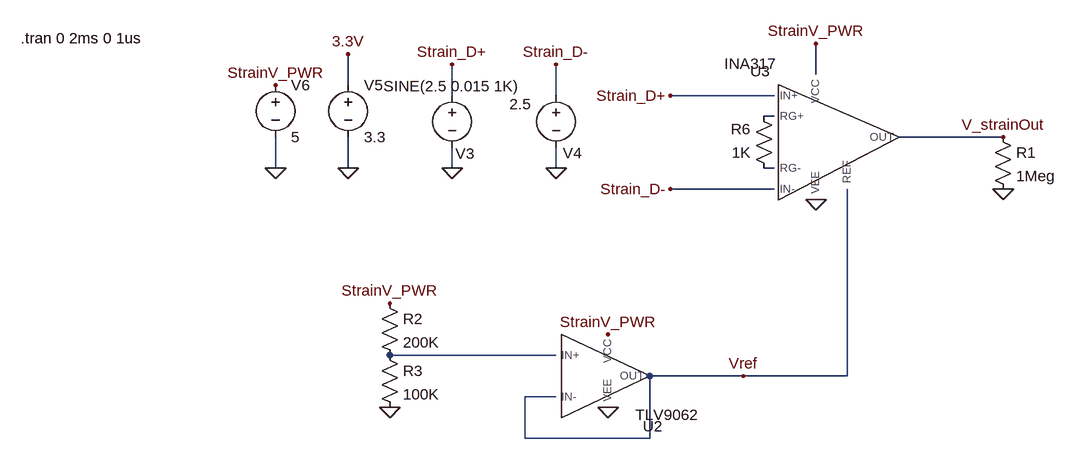
[diagram p0: schematic strainAmplifier.asc]
strainAmplifier.asc, the LTspice schematic file:
Version 4.1
SHEET 1 2284 1760
WIRE 1840 -320 1840 -368
WIRE 1120 -304 1120 -352
WIRE 1280 -288 1280 -336
WIRE 1440 -288 1440 -336
WIRE 1776 -288 1616 -288
WIRE 1776 -256 1760 -256
WIRE 2128 -224 1968 -224
WIRE 1008 -176 1008 -224
WIRE 1120 -176 1120 -224
WIRE 1280 -176 1280 -208
WIRE 1440 -176 1440 -208
WIRE 1776 -176 1760 -176
WIRE 1776 -144 1616 -144
WIRE 1440 112 1184 112
WIRE 1728 144 1584 144
WIRE 1888 144 1888 -144
WIRE 1888 144 1728 144
WIRE 1440 176 1392 176
WIRE 1392 240 1392 176
WIRE 1584 240 1584 144
WIRE 1584 240 1392 240
FLAG 1280 -336 Strain_D+
FLAG 1440 -336 Strain_D-
FLAG 1616 -288 Strain_D+
FLAG 1616 -144 Strain_D-
FLAG 1840 -368 StrainV_PWR
FLAG 1840 -128 0
FLAG 1280 -176 0
FLAG 1440 -176 0
FLAG 1120 -176 0
FLAG 1120 -352 3.3V
FLAG 1008 -176 0
FLAG 1008 -304 StrainV_PWR
FLAG 1728 144 Vref
FLAG 1184 32 StrainV_PWR
FLAG 1184 192 0
FLAG 1520 80 StrainV_PWR
FLAG 1520 192 0
FLAG 2128 -144 0
FLAG 2128 -224 V_strainOut
SYMBOL voltage 1280 -304 R0
WINDOW 0 20 90 Top 2
WINDOW 3 -1 17 Bottom 2
WINDOW 123 0 0 Left 0
WINDOW 39 0 0 Left 0
SYMATTR InstName V3
SYMATTR Value SINE(2.5 0.015 1K)
SYMBOL voltage 1440 -304 R0
WINDOW 0 25 89 Top 2
WINDOW 3 -55 45 Bottom 2
WINDOW 123 0 0 Left 0
WINDOW 39 0 0 Left 0
SYMATTR InstName V4
SYMATTR Value 2.5
SYMBOL res 1776 -160 R180
WINDOW 0 36 76 Left 2
WINDOW 3 36 40 Left 2
SYMATTR InstName R6
SYMATTR Value 1K
SYMBOL voltage 1120 -320 R0
WINDOW 123 0 0 Left 0
WINDOW 39 0 0 Left 0
SYMATTR InstName V5
SYMATTR Value 3.3
SYMBOL voltage 1008 -320 R0
WINDOW 123 0 0 Left 0
WINDOW 39 0 0 Left 0
SYMATTR InstName V6
SYMATTR Value 5
SYMBOL library\\INA317 1840 -224 R0
SYMATTR InstName U3
SYMBOL res 1168 16 R0
SYMATTR InstName R2
SYMATTR Value 200K
SYMBOL res 1168 96 R0
SYMATTR InstName R3
SYMATTR Value 100K
SYMBOL res 2112 -240 R0
SYMATTR InstName R1
SYMATTR Value 1Meg
SYMBOL library\\TLV9062 1504 144 R0
SYMATTR InstName U2
TEXT 616 -376 Left 2 !.tran 0 2ms 0 1us

The netlist it stands for:
* strainAmplifier.asc
V3 Strain_D+ 0 SINE(2.5 0.015 1K)
V4 Strain_D- 0 2.5
R6 N002 N001 1K
V5 3.3V 0 3.3
V6 StrainV_PWR 0 5
X§U3 Strain_D+ Strain_D- StrainV_PWR 0 V_strainOut Vref N001 N002 INA317  ; pins IN+ IN- VCC VEE OUT REF RG+ RG-
R2 StrainV_PWR N003 200K
R3 N003 0 100K
R1 V_strainOut 0 1Meg
X§U2 N003 Vref StrainV_PWR 0 Vref TLV9062  ; pins IN+ IN- VCC VEE OUT
.tran 0 2ms 0 1us
.lib C:\Users\Parry\Documents\BCIT-BAJA\testing\LTSPICE_SIMS\library\INA317.LIB
.lib C:\Users\Parry\Documents\BCIT-BAJA\testing\LTSPICE_SIMS\library\tlv9062.LIB
.backanno
.end